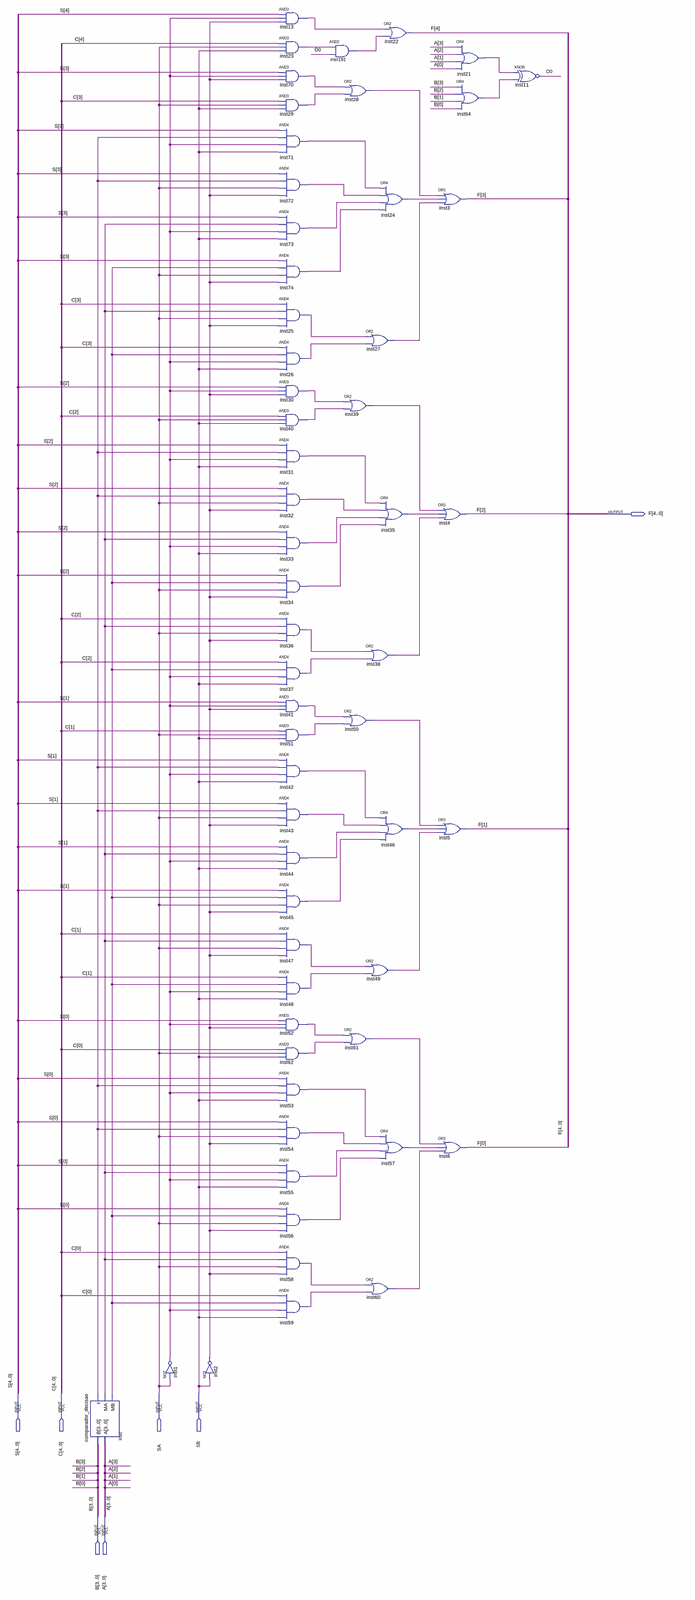
[diagram p0: schematic sheet, whole]
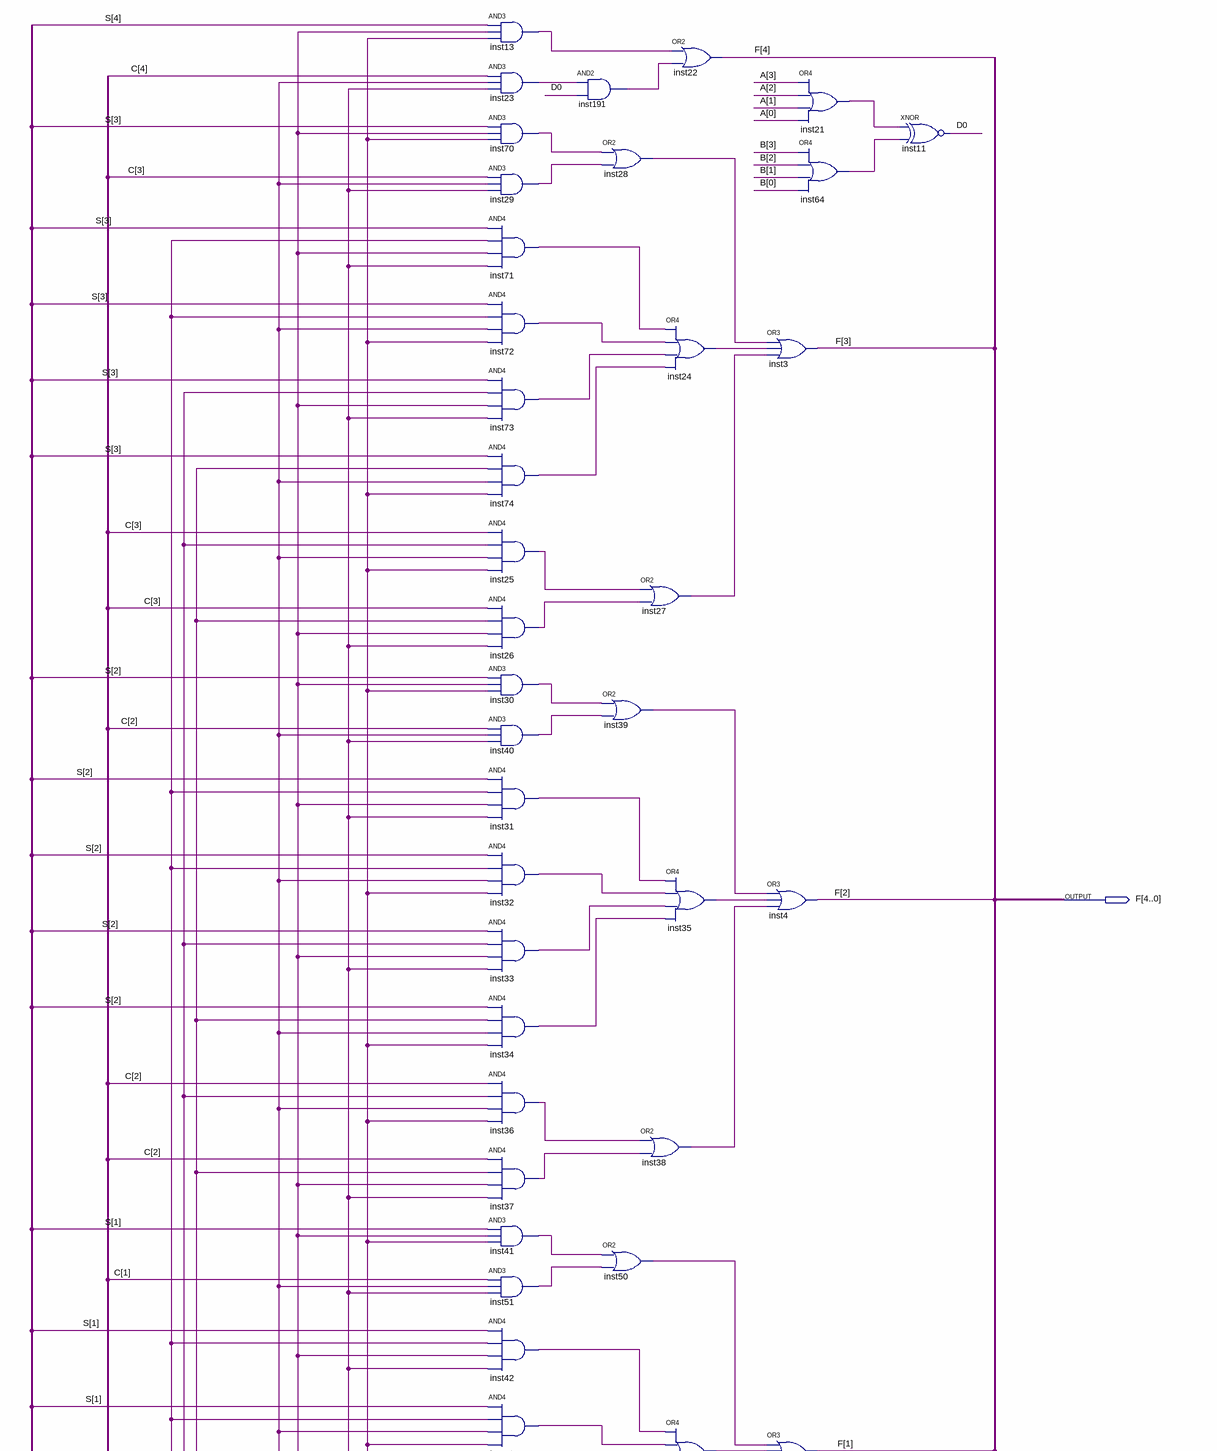
[diagram p1: schematic sheet, upper part]
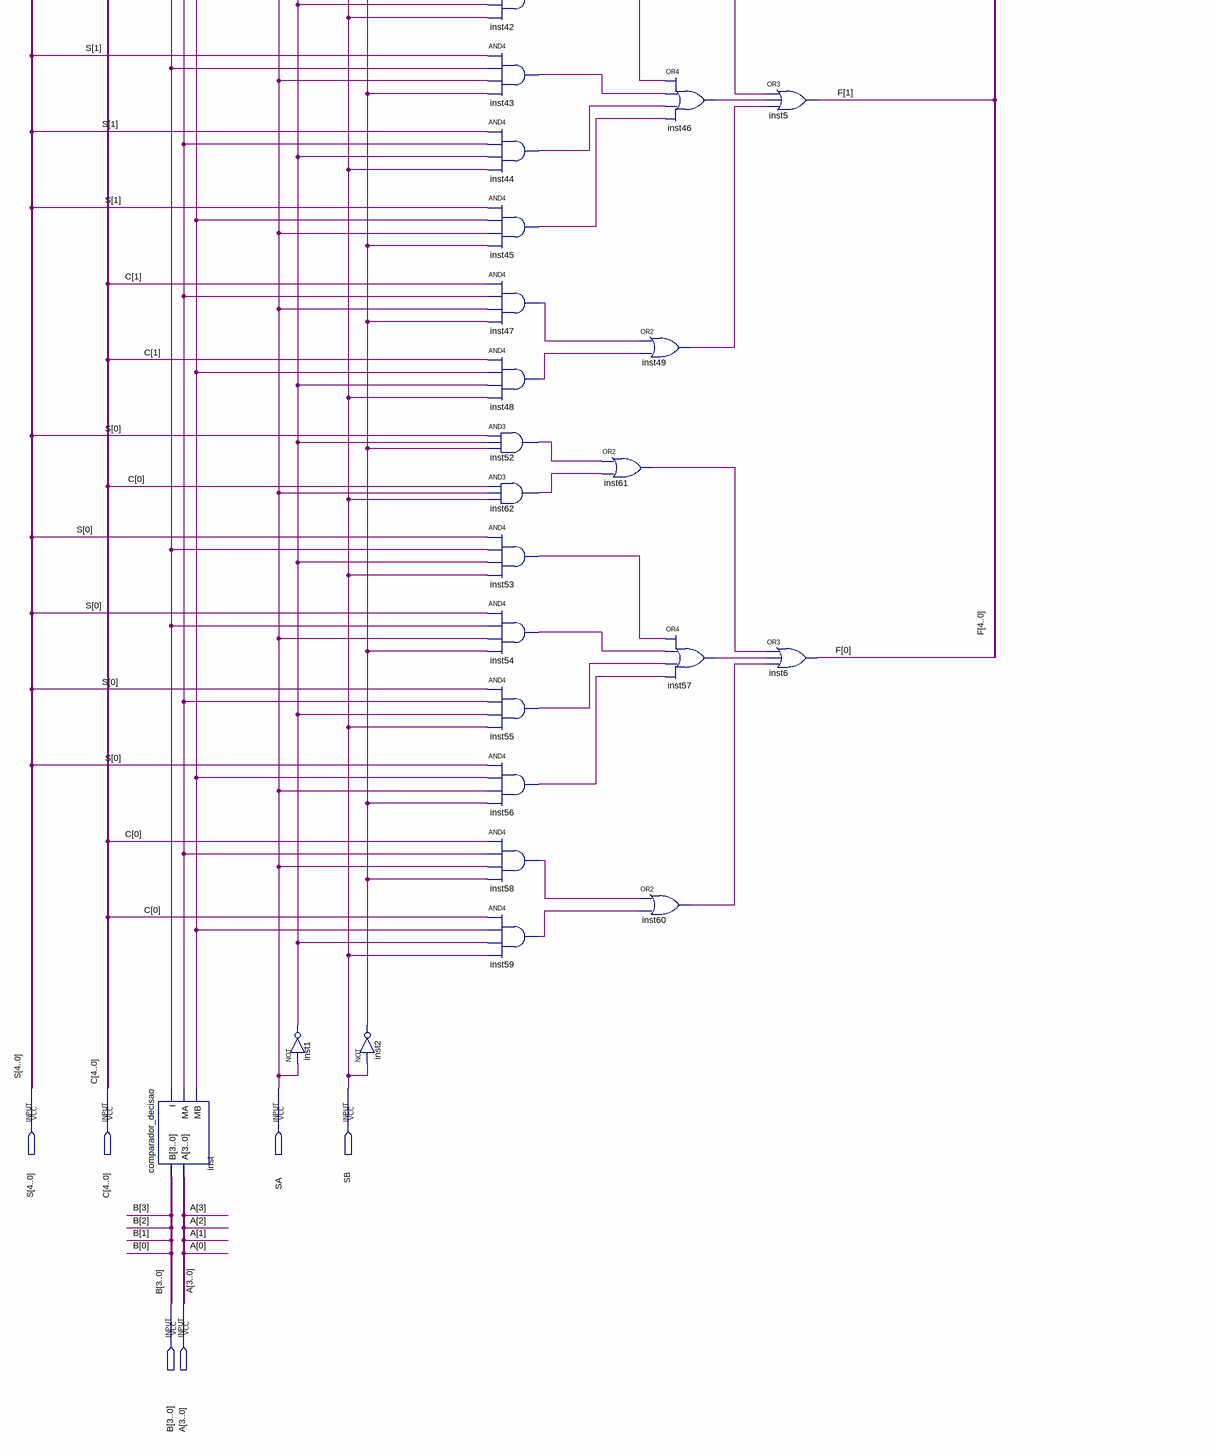
[diagram p2: schematic sheet, lower part]
// Quartus schematic circuito_carry.bdf as structural Verilog: 58 symbols, 7 pins
module circuito_carry (
  input  [4:0] S,
  input  [4:0] C,
  input  SA,
  input  SB,
  input  [3:0] B,
  input  [3:0] A,
  output [4:0] F
);

  wire D0, inst1_out, inst2_out, inst13_out, inst21_out, inst23_out, inst24_out, inst25_out, inst26_out,
       inst27_out, inst28_out, inst29_out, inst30_out, inst31_out, inst32_out, inst33_out, inst34_out,
       inst35_out, inst36_out, inst37_out, inst38_out, inst39_out, inst40_out, inst41_out, inst42_out,
       inst43_out, inst44_out, inst45_out, inst46_out, inst47_out, inst48_out, inst49_out, inst50_out,
       inst51_out, inst52_out, inst53_out, inst54_out, inst55_out, inst56_out, inst57_out, inst58_out,
       inst59_out, inst60_out, inst61_out, inst62_out, inst64_out, inst70_out, inst71_out, inst72_out,
       inst73_out, inst74_out, inst191_out, inst_i, inst_ma, inst_mb;

  comparador_decisao inst (.B(B), .A(A), .I(inst_i), .MA(inst_ma), .MB(inst_mb));
  not inst1 (inst1_out, SA);
  not inst2 (inst2_out, SB);
  and inst13 (inst13_out, S[4], inst1_out, inst2_out);
  and inst23 (inst23_out, C[4], SA, SB);
  and inst70 (inst70_out, S[3], inst1_out, inst2_out);
  and inst29 (inst29_out, C[3], SA, SB);
  and inst71 (inst71_out, S[3], inst_i, inst1_out, SB);
  and inst72 (inst72_out, S[3], inst_i, SA, inst2_out);
  and inst73 (inst73_out, S[3], inst_ma, inst1_out, SB);
  and inst74 (inst74_out, S[3], inst_mb, SA, inst2_out);
  and inst25 (inst25_out, C[3], inst_ma, SA, inst2_out);
  and inst26 (inst26_out, C[3], inst_mb, inst1_out, SB);
  and inst30 (inst30_out, S[2], inst1_out, inst2_out);
  and inst40 (inst40_out, C[2], SA, SB);
  and inst31 (inst31_out, S[2], inst_i, inst1_out, SB);
  and inst32 (inst32_out, S[2], inst_i, SA, inst2_out);
  and inst33 (inst33_out, S[2], inst_ma, inst1_out, SB);
  and inst34 (inst34_out, S[2], inst_mb, SA, inst2_out);
  and inst36 (inst36_out, C[2], inst_ma, SA, inst2_out);
  and inst37 (inst37_out, C[2], inst_mb, inst1_out, SB);
  and inst41 (inst41_out, S[1], inst1_out, inst2_out);
  and inst51 (inst51_out, C[1], SA, SB);
  and inst42 (inst42_out, S[1], inst_i, inst1_out, SB);
  and inst43 (inst43_out, S[1], inst_i, SA, inst2_out);
  and inst44 (inst44_out, S[1], inst_ma, inst1_out, SB);
  and inst45 (inst45_out, S[1], inst_mb, SA, inst2_out);
  and inst47 (inst47_out, C[1], inst_ma, SA, inst2_out);
  and inst48 (inst48_out, C[1], inst_mb, inst1_out, SB);
  and inst52 (inst52_out, S[0], inst1_out, inst2_out);
  and inst62 (inst62_out, C[0], SA, SB);
  and inst53 (inst53_out, S[0], inst_i, inst1_out, SB);
  and inst54 (inst54_out, S[0], inst_i, SA, inst2_out);
  and inst55 (inst55_out, S[0], inst_ma, inst1_out, SB);
  and inst56 (inst56_out, S[0], inst_mb, SA, inst2_out);
  and inst58 (inst58_out, C[0], inst_ma, SA, inst2_out);
  and inst59 (inst59_out, C[0], inst_mb, inst1_out, SB);
  and inst191 (inst191_out, inst23_out, D0);
  or inst28 (inst28_out, inst70_out, inst29_out);
  or inst39 (inst39_out, inst30_out, inst40_out);
  or inst50 (inst50_out, inst41_out, inst51_out);
  or inst61 (inst61_out, inst52_out, inst62_out);
  or inst22 (F[4], inst13_out, inst191_out);
  or inst24 (inst24_out, inst71_out, inst72_out, inst73_out, inst74_out);
  or inst27 (inst27_out, inst25_out, inst26_out);
  or inst35 (inst35_out, inst31_out, inst32_out, inst33_out, inst34_out);
  or inst38 (inst38_out, inst36_out, inst37_out);
  or inst46 (inst46_out, inst42_out, inst43_out, inst44_out, inst45_out);
  or inst49 (inst49_out, inst47_out, inst48_out);
  or inst57 (inst57_out, inst53_out, inst54_out, inst55_out, inst56_out);
  or inst60 (inst60_out, inst58_out, inst59_out);
  or inst3 (F[3], inst28_out, inst24_out, inst27_out);
  or inst4 (F[2], inst39_out, inst35_out, inst38_out);
  or inst5 (F[1], inst50_out, inst46_out, inst49_out);
  or inst6 (F[0], inst61_out, inst57_out, inst60_out);
  or inst21 (inst21_out, A[3], A[2], A[1], A[0]);
  or inst64 (inst64_out, B[3], B[2], B[1], B[0]);
  xnor inst11 (D0, inst21_out, inst64_out);
endmodule
